# Altium schematic sheet Leds.SchDoc: RGB LEDs
size A3; Organization: Use Organization_Name in ProjParam; Address1: Eliot Ferragni; Address2: STI-MOBOTS; Address3: EPFL; Address4: CH-1015 LAUSANNE; DocumentNumber: 6; Revision: A; SheetNumber: 6; SheetTotal: 11; ApprovedBy: Init ApprovedBy in DocParam; CheckedBy: Init CheckedBy in DocParam; Author: Init Author in DocParam; CompanyName: Init CompanyName in DocParam; DrawnBy: Init DrawBy in DocParam; Engineer: Init Engineer in DocParam; Title2: RGB LEDs for the prog, the main uC and the ESP32; DocumentName: Init DocumentName in DocParam; ProjectName: Init ProjectName in DocParam
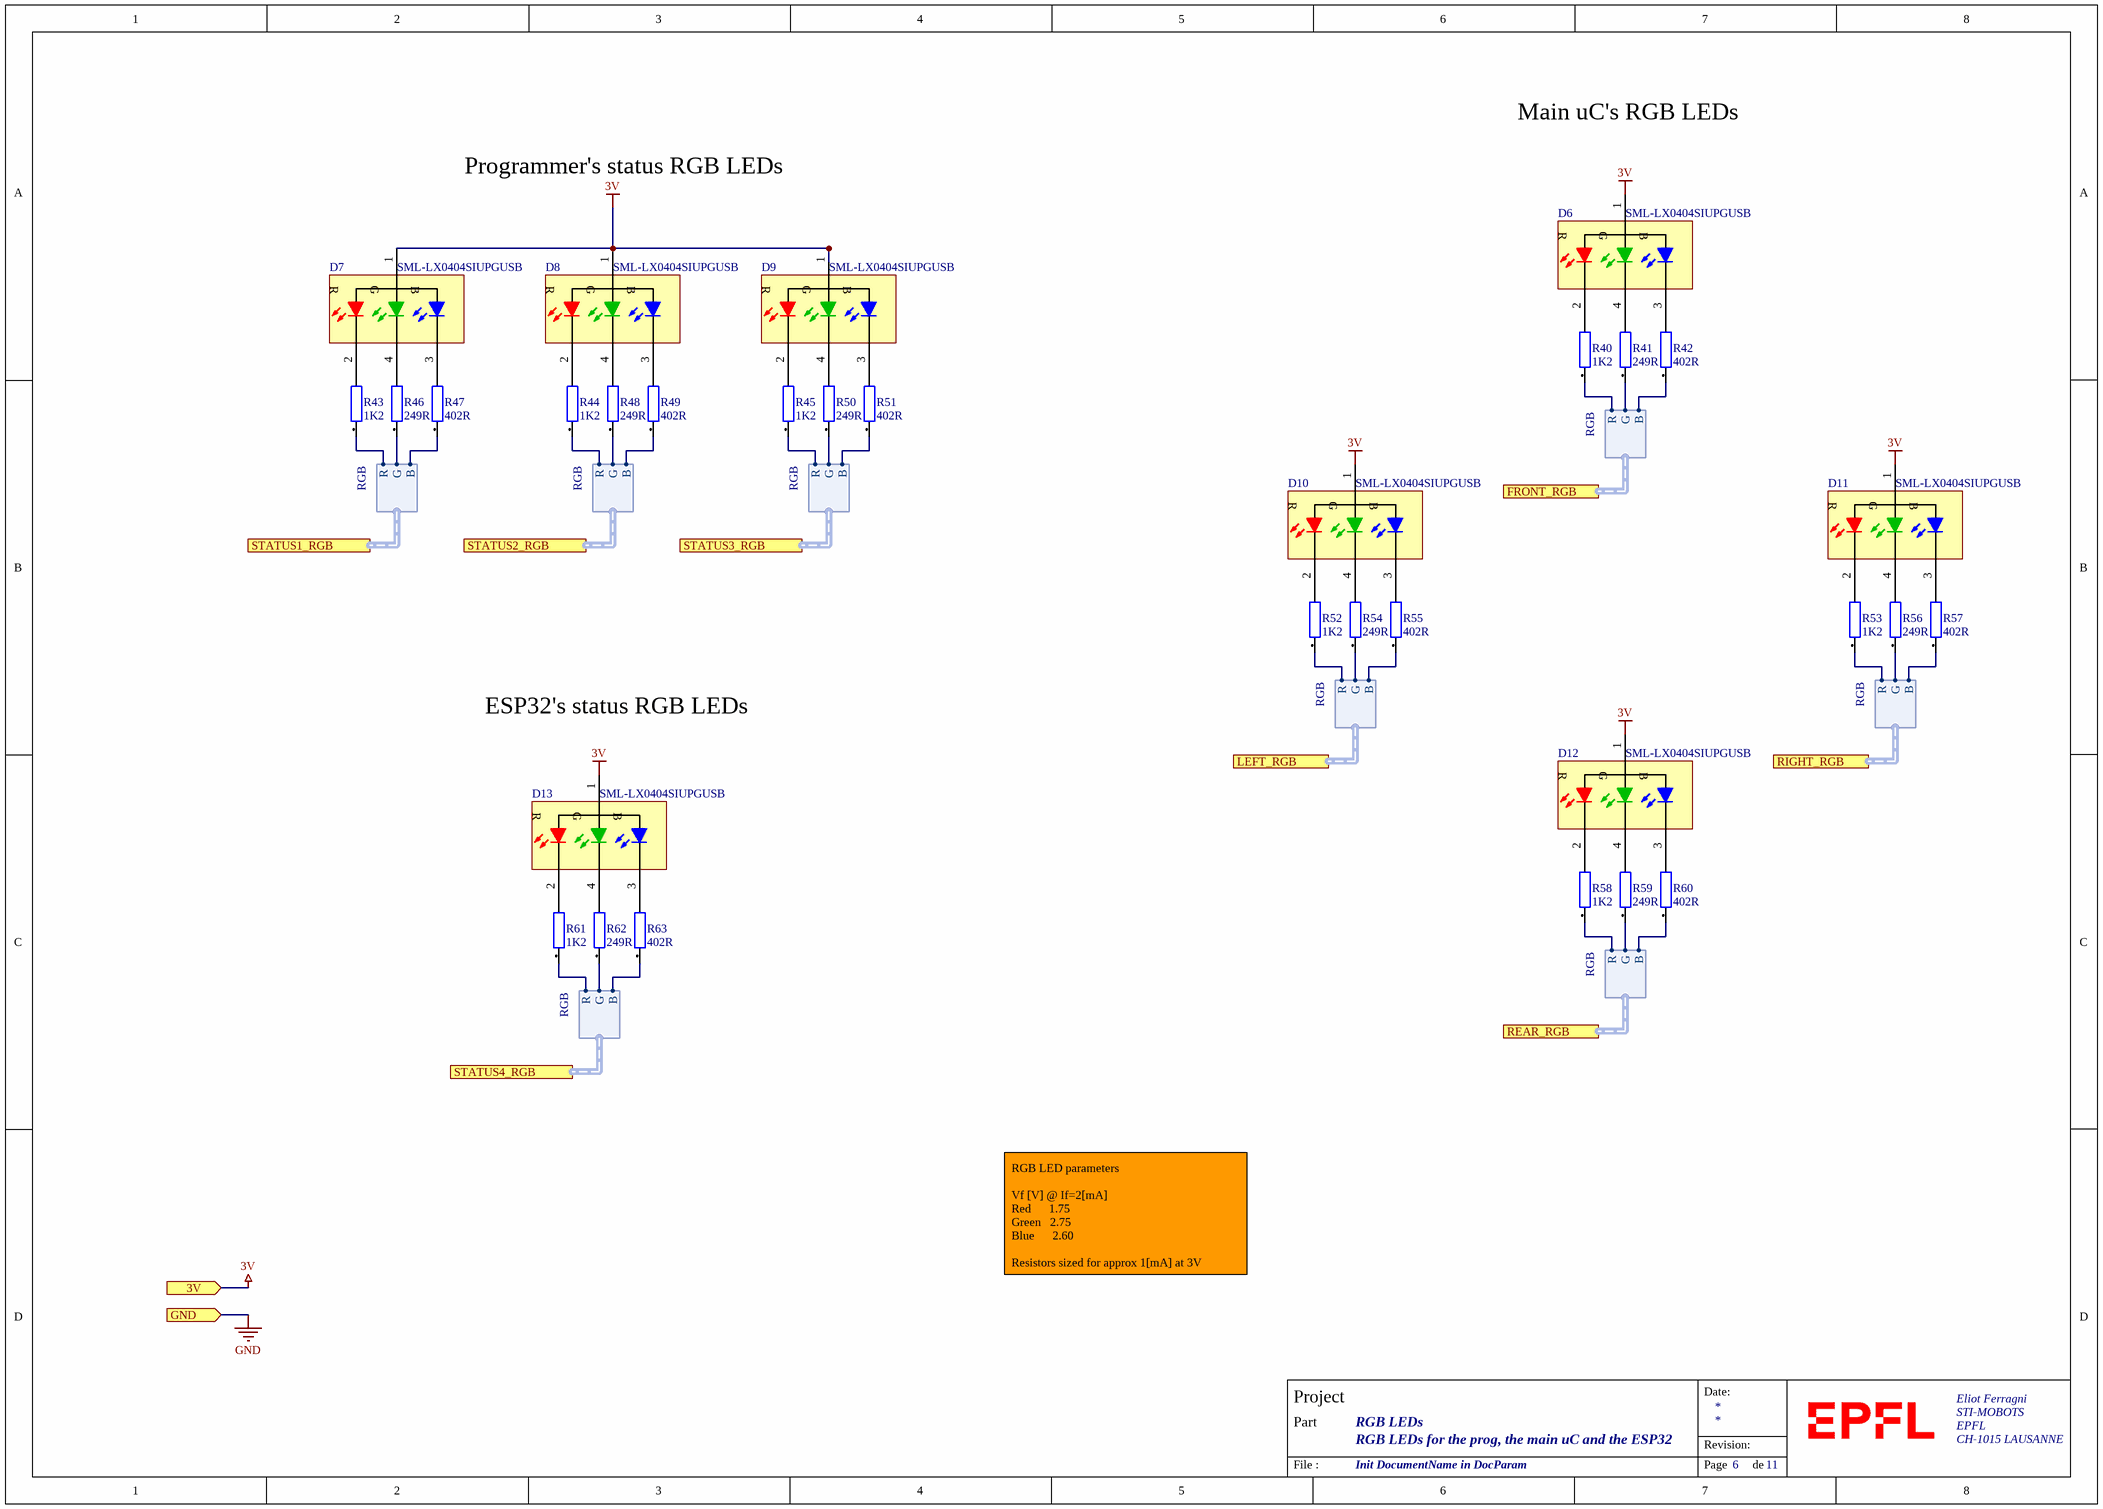
[diagram p0: Leds.SchDoc]

## Parts
D6  SML-LX0404SIUPGUSB  [LUMEX_SML-LX0404SIUPGUSB]
D7  SML-LX0404SIUPGUSB  [LUMEX_SML-LX0404SIUPGUSB]
D8  SML-LX0404SIUPGUSB  [LUMEX_SML-LX0404SIUPGUSB]
D9  SML-LX0404SIUPGUSB  [LUMEX_SML-LX0404SIUPGUSB]
D10  SML-LX0404SIUPGUSB  [LUMEX_SML-LX0404SIUPGUSB]
D11  SML-LX0404SIUPGUSB  [LUMEX_SML-LX0404SIUPGUSB]
D12  SML-LX0404SIUPGUSB  [LUMEX_SML-LX0404SIUPGUSB]
D13  SML-LX0404SIUPGUSB  [LUMEX_SML-LX0404SIUPGUSB]
R40  1K2  [RESC0201(0603)_L]
R41  249R  [RESC0201(0603)_L]
R42  402R  [RESC0201(0603)_L]
R43  1K2  [RESC0201(0603)_L]
R44  1K2  [RESC0201(0603)_L]
R45  1K2  [RESC0201(0603)_L]
R46  249R  [RESC0201(0603)_L]
R47  402R  [RESC0201(0603)_L]
R48  249R  [RESC0201(0603)_L]
R49  402R  [RESC0201(0603)_L]
R50  249R  [RESC0201(0603)_L]
R51  402R  [RESC0201(0603)_L]
R52  1K2  [RESC0201(0603)_L]
R53  1K2  [RESC0201(0603)_L]
R54  249R  [RESC0201(0603)_L]
R55  402R  [RESC0201(0603)_L]
R56  249R  [RESC0201(0603)_L]
R57  402R  [RESC0201(0603)_L]
R58  1K2  [RESC0201(0603)_L]
R59  249R  [RESC0201(0603)_L]
R60  402R  [RESC0201(0603)_L]
R61  1K2  [RESC0201(0603)_L]
R62  249R  [RESC0201(0603)_L]
R63  402R  [RESC0201(0603)_L]

## Ports
3V (in), FRONT_RGB (harness RGB), GND (in), LEFT_RGB (harness RGB), REAR_RGB (harness RGB), RIGHT_RGB (harness RGB), STATUS1_RGB (harness RGB), STATUS2_RGB (harness RGB), STATUS3_RGB (harness RGB), STATUS4_RGB (harness RGB)

## Harnesses
RGB: R, G, B

## Nets
3V: D6.1(AC) D7.1(AC) D8.1(AC) D9.1(AC) D10.1(AC) D11.1(AC) D12.1(AC) D13.1(AC) ; port 3V
GND: port GND
NetD6_2: D6.2(RC) R40.2
NetD6_3: D6.3(BC) R42.2
NetD6_4: D6.4(GC) R41.2
NetD7_2: D7.2(RC) R43.2
NetD7_3: D7.3(BC) R47.2
NetD7_4: D7.4(GC) R46.2
NetD8_2: D8.2(RC) R44.2
NetD8_3: D8.3(BC) R49.2
NetD8_4: D8.4(GC) R48.2
NetD9_2: D9.2(RC) R45.2
NetD9_3: D9.3(BC) R51.2
NetD9_4: D9.4(GC) R50.2
NetD10_2: D10.2(RC) R52.2
NetD10_3: D10.3(BC) R55.2
NetD10_4: D10.4(GC) R54.2
NetD11_2: D11.2(RC) R53.2
NetD11_3: D11.3(BC) R57.2
NetD11_4: D11.4(GC) R56.2
NetD12_2: D12.2(RC) R58.2
NetD12_3: D12.3(BC) R60.2
NetD12_4: D12.4(GC) R59.2
NetD13_2: D13.2(RC) R61.2
NetD13_3: D13.3(BC) R63.2
NetD13_4: D13.4(GC) R62.2
NetR40_1: R40.1 ; port FRONT_RGB.R
NetR41_1: R41.1 ; port FRONT_RGB.G
NetR42_1: R42.1 ; port FRONT_RGB.B
NetR43_1: R43.1 ; port STATUS1_RGB.R
NetR44_1: R44.1 ; port STATUS2_RGB.R
NetR45_1: R45.1 ; port STATUS3_RGB.R
NetR46_1: R46.1 ; port STATUS1_RGB.G
NetR47_1: R47.1 ; port STATUS1_RGB.B
NetR48_1: R48.1 ; port STATUS2_RGB.G
NetR49_1: R49.1 ; port STATUS2_RGB.B
NetR50_1: R50.1 ; port STATUS3_RGB.G
NetR51_1: R51.1 ; port STATUS3_RGB.B
NetR52_1: R52.1 ; port LEFT_RGB.R
NetR53_1: R53.1 ; port RIGHT_RGB.R
NetR54_1: R54.1 ; port LEFT_RGB.G
NetR55_1: R55.1 ; port LEFT_RGB.B
NetR56_1: R56.1 ; port RIGHT_RGB.G
NetR57_1: R57.1 ; port RIGHT_RGB.B
NetR58_1: R58.1 ; port REAR_RGB.R
NetR59_1: R59.1 ; port REAR_RGB.G
NetR60_1: R60.1 ; port REAR_RGB.B
NetR61_1: R61.1 ; port STATUS4_RGB.R
NetR62_1: R62.1 ; port STATUS4_RGB.G
NetR63_1: R63.1 ; port STATUS4_RGB.B

## Notes on the sheet
- Programmer's status RGB LEDs
- Main uC's RGB LEDs
- ESP32's status RGB LEDs
- RGB LED parameters
  Vf [V] @ If=2[mA]
  Red      1.75
  Green   2.75
  Blue      2.60
  Resistors sized for approx 1[mA] at 3V
- Date:
- Project
- Part
- Revision:
- File :
- Page
- de
- (in symbol LED-RGB-C243-A1) R; G; B

## Library data of the parts
D6-D13 = LED-RGB-C243-A1: QuasarBrite LED RGB (Full color 0404 SMD LED), 3x 2mA; Manufacturer: Lumex Inc; Preference: 1; Currentie: CHF; Note: To buy by assembler; Size: 0404; Footprint Acort: ToDefine; ComponentLink1URL: http://www.lumex.com/en/products/detail/leds7/surface_mount4/0404_package/; ComponentLink1Description: Manufacturer link; Supplier 1: Mouser; Supplier Part Number 1: 696-LX0404SIUPGUSB; ComponentLink2Description: Supplier link; ComponentLink2URL: http://www.mouser.ch/ProductDetail/Lumex/SML-LX0404SIUPGUSB/?qs=%2fha2pyFaduhVJD5ZRhDg%2ft7CXH9HmwqzW0VFa3tCuDCfVLKu7L8ofw8YssAqq7i9; Manufacturer Nr: SML-LX0404SIUPGUSB; ROHS: True; DateLastUpdate: 2015-06-26 / 09:49:20; Type: SMD; Manufacturer part number: SML-LX0404SIUPGUSB; Package / Case: LED 0404
R40-R63 = TBD[[/\]]0201[[/\]]1: Resistor 0201; Preference: 1; Currentie: CHF; Note: To buy by assembler; Size: 0201; Footprint Acort: 0201; ROHS: True; DateLastUpdate: 2018-10-19 / 9:06:49 AM; Type: SMD; Manufacturer: -; Manufacturer part number: -; Package / Case: Resistor 0201